# Altium schematic sheet MDBU020.SchDoc (part 2 of 2)
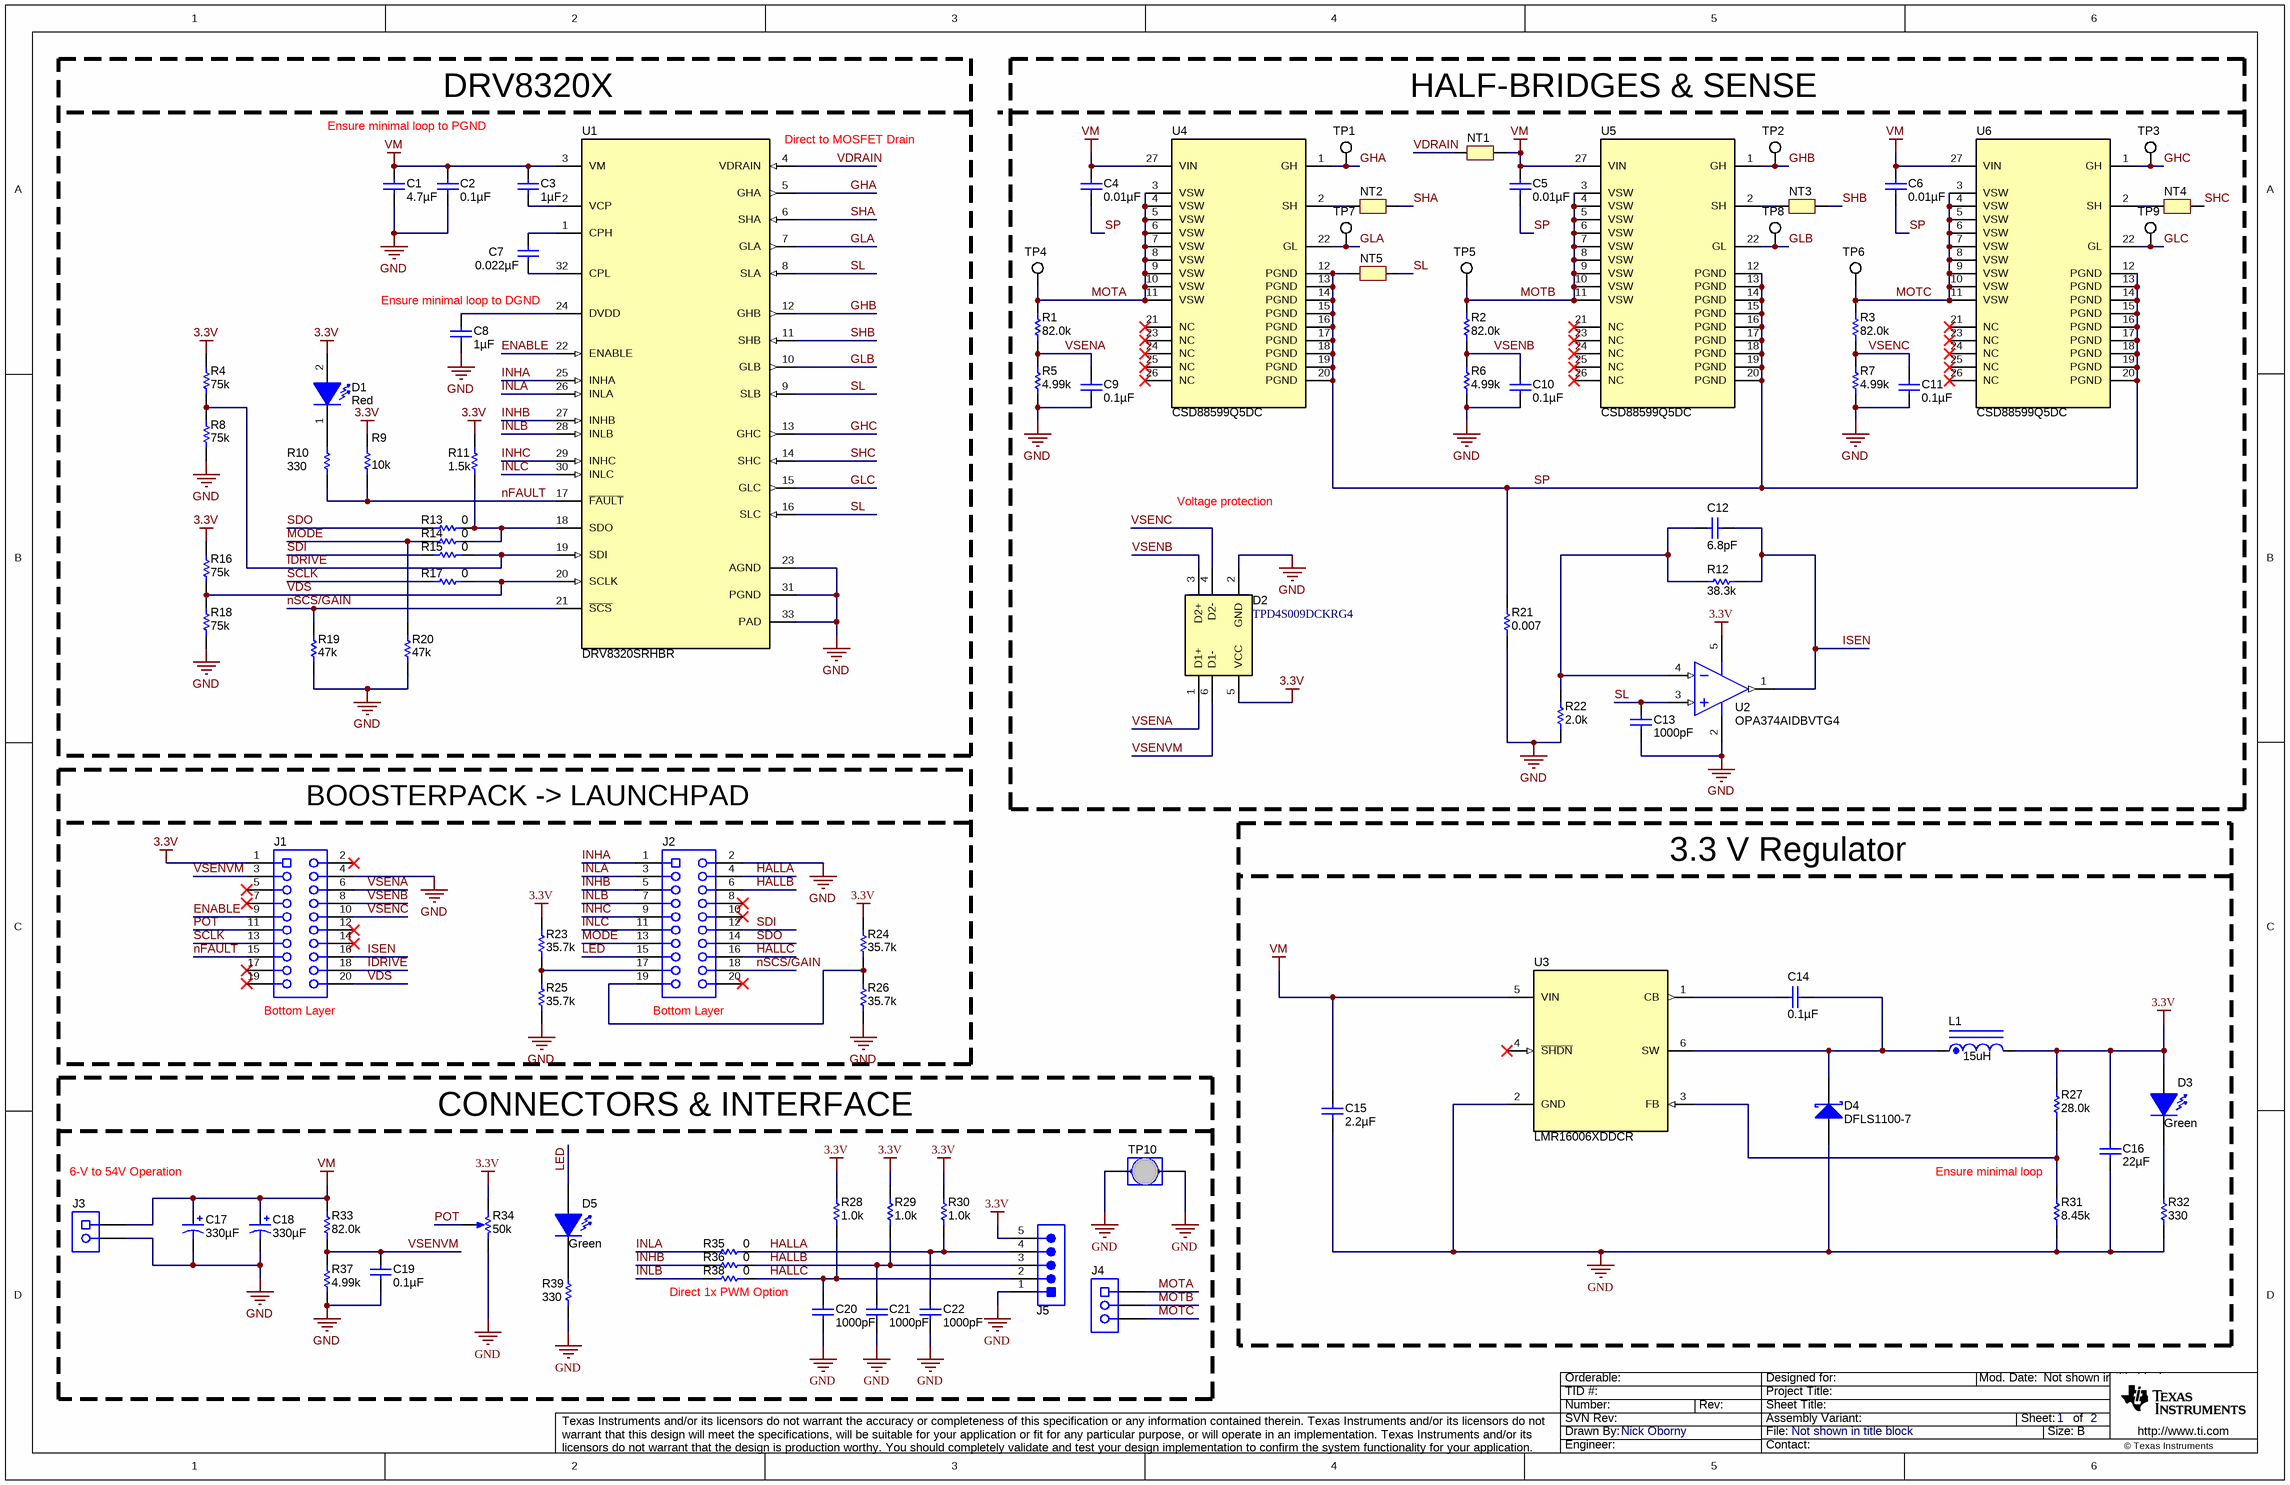
[diagram p1: MDBU020.SchDoc]

## Library data of the parts
C1 = CGA6M3X7S2A475K200AB: CAP, CERM, 4.7 µF, 100 V, +/- 10%, X7S, AEC-Q200 Grade 1, 1210; Manufacturer: TDK; Polarized: N; CompType: Capacitor; Value: 4.7uF; U/M: EA; Cap_F: 0.0000047; Tolerance_%: 10; ESR_ohm: 0.004236; Value1: 0.004236 ohm; VDC_V: 100; Value2: 100V; IRMS_A: 3.57337; TaMin_C: -55; TaMax_C: 125; Cap_Case: 1210_220; SizeArea_mm2: 8; SizeAreaWB_mm2: 14.7; SizeX_mm: 3.2; SizeY_mm: 2.5; SizeZ_mm: 2.2; AEC Category: Q200; AEC Qualified: Y; AEC Grade: 1; SymbolVersion: 2008-07-09; PartNumber: CGA6M3X7S2A475K200AB; PackageReference: 1210; RoHS: Y; MountType: SMT; Technology: Ceramic; TempCo: X7S; Published: 2008-06-19; Publisher: Texas Instruments; LatestRevisionDate: 2017-04-03; ComponentLink1Description: Datasheet link; ComponentLink1URL: https://product.tdk.com/en/search/capacitor/ceramic/mlcc/info?part_no=CGA6M3X7S2A475K200AB; Supplier 1: Digi-Key; Supplier Part Number 1: 445-7005-1-ND; Supplier 2: Mouser; Supplier Part Number 2: 810-CGA6M3X7S2A475K200AB
C2 = C1608X7S2A104K080AB: CAP, CERM, 0.1 µF, 100 V, +/- 10%, X7S, 0603; Manufacturer: TDK; Polarized: N; CompType: Capacitor; Value: 0.1uF; U/M: EA; Cap_F: 0.0000001; Tolerance_%: 10; ESR_ohm: 0.04959; Value1: 0.04959 ohm; VDC_V: 100; Value2: 100V; IRMS_A: 0.751618; TaMin_C: -55; TaMax_C: 125; Cap_Case: 0603; AEC Category: Q200; SizeArea_mm2: 1.28; SizeAreaWB_mm2: 4.68; SizeX_mm: 1.6; SizeY_mm: 0.8; SizeZ_mm: 1; SymbolVersion: 2008-07-09; PartNumber: C1608X7S2A104K080AB; PackageReference: 0603; RoHS: Y; MountType: SMT; Technology: Ceramic; TempCo: X7S; Published: 2008-06-19; Publisher: Texas Instruments; LatestRevisionDate: 2017-04-03; ComponentLink1Description: Datasheet link; ComponentLink1URL: https://product.tdk.com/en/search/capacitor/ceramic/mlcc/info?part_no=C1608X7S2A104K080AB; Supplier 1: Digi-Key; Supplier Part Number 1: 445-5201-1-ND; Supplier 2: Mouser; Supplier Part Number 2: 810-C1608X7S2A104K080AB; AEC Qualified: N; AEC Grade: N/A
C3 = GRM188R71C105KA12D: CAP, CERM, 1 µF, 16 V, +/- 10%, X7R, 0603; Manufacturer: MuRata; Polarized: N; CompType: Capacitor; Value: 1uF; U/M: EA; Cap_F: 0.000001; Tolerance_%: 10; ESR_ohm: 0.011; Value1: 0.011 ohm; VDC_V: 16; Value2: 16V; TaMin_C: -55; TaMax_C: 125; Cap_Case: 0603; SizeArea_mm2: 1.28; SizeAreaWB_mm2: 4.68; SizeX_mm: 1.6; SizeY_mm: 0.8; SizeZ_mm: 1; AEC Category: Q200; SymbolVersion: 2008-07-09; PartNumber: GRM188R71C105KA12D; PackageReference: 0603; RoHS: Y; MountType: SMT; Technology: Ceramic; TempCo: X7R; Published: 2008-06-19; Publisher: Texas Instruments; LatestRevisionDate: 2017-04-03; ComponentLink1Description: Datasheet link; ComponentLink1URL: http://search.murata.co.jp/Ceramy/PnsearchViewAction.do?HnOFG=ON&HnNFG=ON&SEL_CNT=50&sLang=en&sKey=GRM188R71C105KA12D&x=9&y=9&search=startwith; Supplier 1: Digi-Key; Supplier Part Number 1: 490-3900-1-ND; Supplier 2: Mouser; Supplier Part Number 2: 81-GRM188R71C105KA12; Supplier 3: Farnell; Supplier Part Number 3: 1828826; AEC Qualified: ?
C4-C6 = GRM188R72A103KA01D: CAP, CERM, 0.01 µF, 100 V, +/- 10%, X7R, 0603; Manufacturer: MuRata; Polarized: N; CompType: Capacitor; Value: 0.01uF; U/M: EA; Cap_F: 0.00000001; Tolerance_%: 10; Value1: Unknown; VDC_V: 100; Value2: 100V; TaMin_C: -55; TaMax_C: 125; Cap_Case: 0603; AEC Category: Q200; SizeArea_mm2: 1.28; SizeAreaWB_mm2: 4.68; SizeX_mm: 1.6; SizeY_mm: 0.8; SizeZ_mm: 1; SymbolVersion: 2008-07-09; PartNumber: GRM188R72A103KA01D; PackageReference: 0603; RoHS: Y; MountType: SMT; Technology: Ceramic; TempCo: X7R; Published: 2008-06-19; Publisher: Texas Instruments; LatestRevisionDate: 2017-04-03; ComponentLink1Description: Datasheet link; ComponentLink1URL: http://search.murata.co.jp/Ceramy/PnsearchViewAction.do?HnOFG=ON&HnNFG=ON&SEL_CNT=50&sLang=en&sKey=GRM188R72A103KA01D&x=9&y=9&search=startwith; Supplier 1: Digi-Key; Supplier Part Number 1: GRM188R72A103KA01D-ND; Supplier 2: Mouser; Supplier Part Number 2: 81-GRM188R72A103KA1D; AEC Qualified: ?
C7 = C1608X7R2A223K: CAP, CERM, 0.022 µF, 100 V, +/- 10%, X7R, 0603; Manufacturer: TDK; Polarized: N; CompType: Capacitor; Value: 0.022uF; U/M: EA; Cap_F: 0.000000022; Tolerance_%: 10; ESR_ohm: 0.037; Value1: 0.037 ohm; VDC_V: 100; Value2: 100V; TaMin_C: -55; TaMax_C: 125; Cap_Case: 0603; AEC Category: Q200; SymbolVersion: 2008-07-09; PartNumber: C1608X7R2A223K; PackageReference: 0603; RoHS: Y; MountType: SMT; Technology: Ceramic; TempCo: X7R; Published: 2008-06-19; Publisher: Texas Instruments; LatestRevisionDate: 2016-03-19; ComponentLink1Description: Datasheet link; ComponentLink1URL: http://www.tdk.co.jp/tefe02/e412_c.pdf; Supplier 1: Digi-Key; Supplier Part Number 1: 445-2275-1-ND; Supplier 2: Farnell; Supplier Part Number 2: 1844406; AEC Qualified: ?
C8 = GRM188R70J105KA01D: CAP, CERM, 1 µF, 6.3 V, +/- 10%, X7R, 0603; Manufacturer: MuRata; Polarized: N; CompType: Capacitor; Value: 1uF; U/M: EA; Cap_F: 0.000001; Tolerance_%: 10; Value1: Unknown; VDC_V: 6.3; Value2: 6.3V; TaMin_C: -55; TaMax_C: 125; Cap_Case: 0603; AEC Category: Q200; SymbolVersion: 2008-07-09; PartNumber: GRM188R70J105KA01D; PackageReference: 0603; RoHS: Y; MountType: SMT; Technology: Ceramic; TempCo: X7R; Published: 2008-06-19; Publisher: Texas Instruments; LatestRevisionDate: 2016-03-19; ComponentLink1Description: Datasheet link; ComponentLink1URL: http://search.murata.co.jp/Ceramy/PnsearchViewAction.do?HnOFG=ON&HnNFG=ON&SEL_CNT=50&sLang=en&sKey=GRM188R70J105KA01D&x=9&y=9&search=startwith; Supplier 1: Digi-Key; Supplier Part Number 1: 490-3898-1-ND; Supplier 2: Mouser; Supplier Part Number 2: 81-GRM188R70J105KA01; Supplier 3: Farnell; Supplier Part Number 3: 1845765; AEC Qualified: ?
C9-C11 = GRM188R71C104KA01D: CAP, CERM, 0.1 µF, 16 V, +/- 10%, X7R, 0603; Manufacturer: MuRata; Polarized: N; CompType: Capacitor; Value: 0.1uF; U/M: EA; Cap_F: 0.0000001; Tolerance_%: 10; Value1: Unknown; VDC_V: 16; Value2: 16V; TaMin_C: -55; TaMax_C: 125; Cap_Case: 0603; SizeArea_mm2: 1.28; SizeAreaWB_mm2: 4.68; SizeX_mm: 1.6; SizeY_mm: 0.8; SizeZ_mm: 1; AEC Category: Q200; SymbolVersion: 2008-07-09; PartNumber: GRM188R71C104KA01D; PackageReference: 0603; RoHS: Y; MountType: SMT; Technology: Ceramic; TempCo: X7R; Published: 2008-06-19; Publisher: Texas Instruments; LatestRevisionDate: 2017-04-03; ComponentLink1Description: Datasheet link; ComponentLink1URL: http://search.murata.co.jp/Ceramy/PnsearchViewAction.do?HnOFG=ON&HnNFG=ON&SEL_CNT=50&sLang=en&sKey=GRM188R71C104KA01D&x=9&y=9&search=startwith; Supplier 1: Digi-Key; Supplier Part Number 1: 490-1532-1-ND; Supplier 2: Mouser; Supplier Part Number 2: 81-GRM39X104K16; Supplier 3: Farnell; Supplier Part Number 3: 1828890; AEC Qualified: ?
C12 = 06035A6R8CAT2A: CAP, CERM, 6.8 pF, 50 V, +/- 4%, C0G/NP0, 0603; Manufacturer: AVX; Polarized: N; CompType: Capacitor; Value: 6.8pF; U/M: EA; Cap_F: 0.0000000000068; Tolerance_%: 4; ESR_ohm: 0.505; Value1: 0.505 ohm; VDC_V: 50; Value2: 50V; TaMin_C: -55; TaMax_C: 125; Cap_Case: 0603; SizeArea_mm2: 1.28; SizeAreaWB_mm2: 4.68; SizeX_mm: 1.6; SizeY_mm: 0.8; SizeZ_mm: 1; AEC Category: Q200; SymbolVersion: 2008-07-09; PartNumber: 06035A6R8CAT2A; PackageReference: 0603; RoHS: Y; MountType: SMT; Technology: Ceramic; TempCo: C0G/NP0; Published: 2008-06-19; Publisher: Texas Instruments; LatestRevisionDate: 2016-07-21; ComponentLink1Description: Datasheet link; ComponentLink1URL: http://datasheets.avx.com/C0GNP0-Dielectric.pdf; Supplier 1: Digi-Key; Supplier Part Number 1: 478-1161-1-ND; Supplier 2: Mouser; Supplier Part Number 2: 581-06035A6R8CAT2A; Supplier 3: Farnell; Supplier Part Number 3: 1396258; AEC Qualified: N; AEC Grade: N/A
C13 C20-C22 = 885012206034: CAP, CERM, 1000 pF, 16 V, +/- 10%, X7R, 0603; Manufacturer: Wurth Elektronik; Polarized: N; CompType: Capacitor; Value: 1000pF; U/M: EA; Cap_F: 0.000000001; Tolerance_%: 10; Value1: Unknown; VDC_V: 16; Value2: 16V; TaMin_C: -55; TaMax_C: 125; Cap_Case: 0603; SizeArea_mm2: 1.28; SizeAreaWB_mm2: 4.68; SizeX_mm: 1.6; SizeY_mm: 0.8; SizeZ_mm: 1; AEC Category: Q200; SymbolVersion: 2008-07-09; PartNumber: 885012206034; PackageReference: 0603; RoHS: Y; MountType: SMT; Technology: Ceramic; TempCo: X7R; Published: 2008-06-19; Publisher: Texas Instruments; LatestRevisionDate: 2016-08-08; ComponentLink1Description: Datasheet link; ComponentLink1URL: http://katalog.we-online.de/pbs/datasheet/885012206034.pdf; Supplier 1: Mouser; Supplier Part Number 1: 710-885012206034; AEC Qualified: N; AEC Grade: N/A
C14 = 0603YC104JAT2A: CAP, CERM, 0.1 µF, 16 V, +/- 5%, X7R, 0603; Manufacturer: AVX; Polarized: N; CompType: Capacitor; Value: 0.1uF; U/M: EA; Cap_F: 0.0000001; Tolerance_%: 5; ESR_ohm: 0.039; Value1: 0.039 ohm; VDC_V: 16; Value2: 16V; TaMin_C: -55; TaMax_C: 125; Cap_Case: 0603; AEC Category: Q200; SymbolVersion: 2008-07-09; PartNumber: 0603YC104JAT2A; PackageReference: 0603; RoHS: Y; MountType: SMT; Technology: Ceramic; TempCo: X7R; Published: 2008-06-19; Publisher: Texas Instruments; LatestRevisionDate: 2016-03-19; ComponentLink1Description: Datasheet link; ComponentLink1URL: http://datasheets.avx.com/X7RDielectric.pdf; Supplier 1: Digi-Key; Supplier Part Number 1: 478-3726-1-ND; Supplier 2: Mouser; Supplier Part Number 2: 581-0603YC104J; Supplier 3: Farnell; Supplier Part Number 3: 1740612; AEC Qualified: N; AEC Grade: N/A
C15 = GRM32ER72A225KA35L: CAP, CERM, 2.2 µF, 100 V, +/- 10%, X7R, 1210; Manufacturer: MuRata; Polarized: N; CompType: Capacitor; Value: 2.2uF; U/M: EA; Cap_F: 0.0000022; Tolerance_%: 10; ESR_ohm: 0.007; Value1: 0.007 ohm; VDC_V: 100; Value2: 100V; IRMS_A: 4.4; TaMin_C: -55; TaMax_C: 125; Cap_Case: 1210; AEC Category: Q200; SymbolVersion: 2008-07-09; PartNumber: GRM32ER72A225KA35L; PackageReference: 1210; RoHS: Y; MountType: SMT; Technology: Ceramic; TempCo: X7R; Published: 2008-06-19; Publisher: Texas Instruments; LatestRevisionDate: 2016-03-19; ComponentLink1Description: Datasheet link; ComponentLink1URL: http://search.murata.co.jp/Ceramy/PnsearchViewAction.do?HnOFG=ON&HnNFG=ON&SEL_CNT=50&sLang=en&sKey=GRM32ER72A225KA35L&x=9&y=9&search=startwith; Supplier 1: Digi-Key; Supplier Part Number 1: 490-3385-1-ND; Supplier 2: Mouser; Supplier Part Number 2: 81-GRM32ER72A225KA35; Supplier 3: Farnell; Supplier Part Number 3: 1735547; AEC Qualified: ?
C16 = GRM31CR61A226KE19L: CAP, CERM, 22 µF, 10 V, +/- 10%, X5R, 1206; Manufacturer: MuRata; Polarized: N; CompType: Capacitor; Value: 22uF; U/M: EA; Cap_F: 0.000022; Tolerance_%: 10; Value1: Unknown; Value2: 10V; TaMin_C: -55; TaMax_C: 85; Cap_Case: 1206; SizeArea_mm2: 5.12; SizeAreaWB_mm2: 10.92; SizeX_mm: 3.2; SizeY_mm: 1.6; SizeZ_mm: 1.8; AEC Category: Q200; SymbolVersion: 2008-07-09; PartNumber: GRM31CR61A226KE19L; PackageReference: 1206; RoHS: Y; VDC_V: 10; MountType: SMT; Technology: Ceramic; TempCo: X5R; Published: 2008-06-19; Publisher: Texas Instruments; LatestRevisionDate: 2016-08-08; ComponentLink1Description: Datasheet link; ComponentLink1URL: http://search.murata.co.jp/Ceramy/PnsearchViewAction.do?HnOFG=ON&HnNFG=ON&SEL_CNT=50&sLang=en&sKey=GRM31CR61A226KE19L&x=9&y=9&search=startwith; Supplier 1: Digi-Key; Supplier Part Number 1: GRM31CR61A226KE19L-ND; Supplier 2: Mouser; Supplier Part Number 2: 81-GRM31CR61A226KE9L; Supplier 3: Farnell; Supplier Part Number 3: 1907515; AEC Qualified: ?
C17 C18 = EMVA630ADA331MKG5S: CAP, AL, 330 µF, 63 V, +/- 20%, SMD; Manufacturer: Chemi-Con; Polarized: Y; CompType: Capacitor; Value: 330uF; U/M: EA; Cap_F: 0.00033; Tolerance_%: 20; Value1: Unknown; VDC_V: 63; Value2: 63V; IRMS_A: 0.72; TaMin_C: -40; TaMax_C: 85; Cap_Case: 12.5x16mm; AEC Category: Q200; AEC Qualified: N; SymbolVersion: 2008-07-09; PartNumber: EMVA630ADA331MKG5S; PackageReference: KG5; RoHS: Y; MountType: SMT; Technology: AL; Series: MVA; Publisher: Texas Instruments; LatestRevisionDate: 2016-05-12; ComponentLink1Description: Datasheet link; ComponentLink1URL: http://www.chemi-con.co.jp/cgi-bin/CAT_DB/SEARCH/cat_db_al.cgi?e=e&j=p&pdfname=mva; Supplier 1: Digi-Key; Supplier Part Number 1: 565-2156-1-ND; AEC Grade: N/A
C19 = C0603C104K4RACTU: CAP, CERM, 0.1 µF, 16 V, +/- 10%, X7R, 0603; Manufacturer: Kemet; Polarized: N; CompType: Capacitor; Value: 0.1uF; U/M: EA; Cap_F: 0.0000001; Tolerance_%: 10; Value1: Unknown; VDC_V: 16; Value2: 16V; TaMin_C: -55; TaMax_C: 125; Cap_Case: 0603; SizeArea_mm2: 1.28; SizeAreaWB_mm2: 4.68; SizeX_mm: 1.6; SizeY_mm: 0.8; SizeZ_mm: 1; AEC Category: Q200; SymbolVersion: 2008-07-09; PartNumber: C0603C104K4RACTU; PackageReference: 0603; RoHS: Y; MountType: SMT; Technology: Ceramic; TempCo: X7R; Published: 2008-06-19; Publisher: Texas Instruments; LatestRevisionDate: 2017-04-03; ComponentLink1Description: Datasheet link; ComponentLink1URL: http://www.kemet.com/kemet/web/homepage/kechome.nsf/vapubfiles/F3102_Y5V.pdf/$file/F3102_Y5V.pdf; Supplier 1: Digi-Key; Supplier Part Number 1: 399-1096-1-ND; Supplier 2: Mouser; Supplier Part Number 2: 80-C0603C104K4R; Supplier 3: Farnell; Supplier Part Number 3: 1414610; AEC Qualified: ?
D1 = 150060RS75000: LED, Red, SMD; Manufacturer: Wurth Elektronik; Type: AlInGaP; Vf_V: 2; Value2: 2V; Io_A: 0.03; Vr_V: 5; Tjmax_C: 85; Power_TotalModule: 0.072; Value1: 0.072W; Angle: 140; U/M: EA; CompType: LED; PartNumber: 150060RS75000; SymbolVersion: 2008-11-06; MountType: SMT; RoHS: Y; PackageReference: LED_0603; Color: Red; Published: 2008-07-11; Publisher: Texas Instruments; ComponentLink1URL: http://katalog.we-online.de/led/datasheet/150060RS75000.pdf; ComponentLink1Description: Datasheet link; LatestRevisionDate: 2016-07-15; Supplier 1: Digi-Key; Supplier Part Number 1: 732-4978-1-ND; Supplier 2: Mouser; Supplier Part Number 2: 710-150060RS75000; Supplier 3: Farnell; Supplier Part Number 3: 2322071
D2 = TPD4S009DCKRG4: ESD Solution for High-Speed Differential Interface, 4 Channels, -40 to +85 degC, 6-pin SC70 (DCK), Green (RoHS & no Sb/Br); Manufacturer: Texas Instruments; Alternate PartNumber: Equivalent; Breakdown Voltage(Min)(V): 9; Differential Capacitance(pF): 0.05; IEC 61000-4-2 Contact(+/- kV): 8; IO Capacitance(Typ)(pF): 0.8; IO Leakage Current(nA): 10; PartNumber: TPD4S009DCKRG4; MountType: SMT; ComponentLink1Description: Datasheet; ComponentLink1URL: http://www.ti.com/general/docs/lit/getliterature.tsp?genericPartNumber=TPD4S009&fileType=pdf; PackageReference: DCK0006A; Alternate Manufacturer: Texas Instruments; Supplier 1: Digi-Key; Supplier Part Number 1: TPD4S009DCKRG4-ND; Supplier 2: Mouser; Supplier Part Number 2: 595-TPD4S009DCKRG4; DatasheetVersion: SLVS817E; PackageVersion: revG, Jan-2007; PackageDescription: 6-Pin Plastic Small-Outline Package, 2 x 1.3 mm Body, 0.65 mm Pitch, 2.1 mm Lead Span; Eco-Plan: Green (RoHS & no Sb/Br); IEC 61000-4-2 Air-Gap(+/- kV): 9; SubFamily: ESD Solution; Code_JEDEC: MO-203-AB; ComponentLink2Description: URL Link1; ComponentLink2URL: SamplesURL:http://www.ti.com/product/tpd4s009#samples
D3 D5 = LTST-C171GKT: LED, Green, SMD; Manufacturer: Lite-On; Type: AlInGaP; Vf_V: 2.1; Value2: 2.1V; Io_A: 20; Value1: W; U/M: EA; CompType: LED; PartNumber: LTST-C171GKT; SymbolVersion: 2008-12-08; MountType: SMT; RoHS: Y; PackageReference: LED_0805; Color: green; Published: 2008-07-11; Publisher: Texas Instruments; ComponentLink1URL: https://sps06.itg.ti.com/sites/KMS/crossdivteams/altium/docs/ComponentDatasheets/LTST-C171GKT.pdf; ComponentLink1Description: Datasheet link; Supplier 1: Digi-Key; Supplier Part Number 1: 160-1423-1-ND; Supplier 2: Mouser; Supplier Part Number 2: 859-LTST-C171GKT
  D3: LatestRevisionDate: 2013-09-07
  D5: LatestRevisionDate: 2015-12-18
D4 = DFLS1100-7: Diode, Schottky, 100 V, 1 A, PowerDI123; Manufacturer: Diodes Inc.; U/M: EA; Vf_V: 0.77; Value: 100V; Value1: 1A; Value2: 0.77V; Io_A: 1; Vr_V: 100; TJmax_C: 175; RJC_CperW: 7; SizeAreaWB_mm2: 13.066; SizeArea_mm2: 6.586; SizeX_mm: 3.7; SizeY_mm: 1.78; SizeZ_mm: 0.98; AEC Category: Q101; CompType: Diode; SymbolVersion: 2008-12-08; PartNumber: DFLS1100-7; PackageReference: PowerDI123; MountType: SMT; Type: Schottky; RoHS: Y; Published: 2008-06-26; Publisher: Texas Instruments; LatestRevisionDate: 2016-12-06; ComponentLink1Description: Datasheet link; ComponentLink1URL: http://www.diodes.com/datasheets/ds30497.pdf; Supplier 1: Digi-Key; Supplier Part Number 1: DFLS1100DICT-ND; Supplier 2: Mouser; Supplier Part Number 2: 621-DFLS1100-7; Supplier 3: Farnell; Supplier Part Number 3: 1713889; AEC Qualified: ?
J1 J2 = SSQ-110-03-G-D: Receptacle, 2.54mm, 10x2, Gold, TH; Manufacturer: Samtec; SymbolCreator: a0412235; Pitch_mm: 2.54; Gender: Female; Row_Count: 2; Current_A: 6.3; Voltage_V: 550; Cert_CSA: Y; Cert_CULUS: N; SymbolVersion: 2013-12-20; PartNumber: SSQ-110-03-G-D; PackageReference: Receptacle, 2.54mm, 10x2, TH; CompType: Receptacle; RoHS: Y; MountType: TH; ComponentLink1Description: Datasheet URL; ComponentLink1URL: https://www.samtec.com/ftppub/cpdf/SSQ-1XX-XX-XXX-X-XX-XXX-XX-X-MKT.pdf; Orientation: Vertical; PinCount: 20; RowSpacing_mm: 2.54; ContactFinish: Gold; Color: Black; Cert_UL: Y; Cert_VDE: N; Publisher: Texas Instruments; LatestRevisionDate: 2016-03-21
J3 = 691 101 710 002: Terminal Block, 5 mm, 2x1, Tin, TH; Manufacturer: Wurth Elektronik eiSos; SymbolCreator: a0412235; U/M: EA; SymbolVersion: 2013-09-04; PartNumber: 691 101 710 002; PackageReference: Terminal Block, 5 mm, 2x1, TH; CompType: Terminal Block; RoHS: Y; MountType: TH; ComponentLink1Description: Datasheet Link; ComponentLink1URL: http://katalog.we-online.de/em/datasheet/6911017100xx.pdf; Publisher: Texas Instruments; LatestRevisionDate: 2015-02-03; Supplier 1: Digi-Key; Supplier Part Number 1: 732-2026-ND; Supplier 2: Mouser; Supplier Part Number 2: 710-691101710002
J4 = 691 101 710 003: Terminal Block, 5 mm, 3x1, Tin, TH; Manufacturer: Wurth Elektronik eiSos; SymbolCreator: a0412235; U/M: EA; SymbolVersion: 2013-10-03; PartNumber: 691 101 710 003; PackageReference: Terminal Block, 5 mm, 3x1, TH; CompType: Terminal Block; RoHS: Y; MountType: TH; ComponentLink1Description: Datasheet Link; ComponentLink1URL: http://katalog.we-online.de/em/datasheet/6911017100xx.pdf; Publisher: Texas Instruments; LatestRevisionDate: 2015-02-03; Supplier 1: Digi-Key; Supplier Part Number 1: 732-2027-ND; Supplier 2: Mouser; Supplier Part Number 2: 710-691101710003
J5 = PEC05SAAN: Header, 2.54mm, 5x1, Tin, TH; Manufacturer: Sullins Connector Solutions; SymbolCreator: a0412235; Pitch_mm: 2.54; Gender: Male; Shrouded: N; Row_Count: 1; Current_A: 3; Voltage_V: 1800; Cert_UL: Y; SymbolVersion: 2013-12-22; PartNumber: PEC05SAAN; PackageReference: Header, 2.54mm, 5x1, TH; ClassName: Header; CompType: Header; RoHS: Y; MountType: TH; ComponentLink1Description: Datasheet URL; ComponentLink1URL: http://www.sullinscorp.com/catalogs/77_PAGE108-109_.100_MALE_HDR.pdf; Orientation: Vertical; PinCount: 5; ContactFinish: Tin; Color: Black; Publisher: Texas Instruments; LatestRevisionDate: 2016-03-04; Supplier 1: Digi-Key; Supplier Part Number 1: S1012E-05-ND
L1 = SD53-150-R: Inductor, Shielded Drum Core, Ferrite, 15 µH, 1.1 A, 0.122 ohm, SMD; Manufacturer: Cooper Bussman; SymbolCreator: a0412235; Ind_H: 15.0E-6; ValueDisplayed: 15µH; Imax_A: 1.1; Irms: 1.1A @ 40C rise; Isat: 1.1A @ 30% inductance drop; DCR_ohm: 0.122; Value2: 1.1A; SymbolVersion: 2013-02-25; PartNumber: SD53-150-R; CompType: Inductor; Value1: 0.122 ohm; Technology: Shielded Drum Core; MountType: SMT; Material: Ferrite; PackageReference: 5.72x3x5.2mm; Published: 2008-06-26; Publisher: Texas Instruments; LatestRevisionDate: 2015-02-09; ComponentLink1Description: Datasheet link; ComponentLink1URL: http://www.cooperindustries.com/content/dam/public/bussmann/Electronics/Resources/Data%20Sheets/Bus_Elx_DS_PM%204149_SD53_Series.pdf; RoHS: Y; Supplier 1: Digi-Key; Supplier Part Number 1: 513-1458-1-ND; Supplier 2: Mouser; Supplier Part Number 2: 704-SD53-150-R; Supplier 3: Newark; Supplier Part Number 3: 99M5528
NT1-NT5 = Net-Tie: Single point connection between nets.; SymbolCreator: codlsc; SymbolVersion: 2009-07-01; MountType: SMT; PackageReference: N/A; Publisher: Texas Instruments; LatestRevisionDate: 2014-12-30; LatestRevisionNote: Added Alternate PartNumber and Alternate Manufacturer parameters to appropriate components.
R1-R3 R33 = RC0603FR-0782KL: RES, 82.0 k, 1%, 0.1 W, 0603; Manufacturer: Yageo America; CompType: Resistor; Value: 82.0k; Res_ohm: 82000; Value_Code: 82k0; Tolerance_%: 1; Power_W: 0.1; Value2: 0.1W; VDC_V: 150; TempCo: 200 ppm/C; U/M: EA; AEC Category: Q200; SymbolVersion: 2009-05-29; PartNumber: RC0603FR-0782KL; PackageReference: 0603; RoHS: Y; Value1: 1%; MountType: SMT; Technology: Thick Film; Published: 2008-06-26; Publisher: Texas Instruments; LatestRevisionDate: 2016-03-05; ComponentLink1Description: Datasheet link; ComponentLink1URL: http://www.yageo.com/pdf/Pu-RC0603_51_PbFree_L_2.pdf; Supplier 1: Digi-Key; Supplier Part Number 1: 311-82.0KHRCT-ND; Supplier 2: Mouser; Supplier Part Number 2: 603-RC0603FR-0782KL; Supplier 3: Farnell; Supplier Part Number 3: 9238719; AEC Qualified: ?
R4 R8 R16 R18 = CRCW060375K0JNEA: RES, 75 k, 5%, 0.1 W, 0603; Manufacturer: Vishay-Dale; CompType: Resistor; Value: 75k; Res_ohm: 75000; Value_Code: 75k0; Tolerance_%: 5; Power_W: 0.1; Value2: 0.1W; VDC_V: 75; TempCo: 200 ppm/C; EIA_Code: E24; U/M: EA; AEC Category: Q200; SymbolVersion: 2009-05-29; PartNumber: CRCW060375K0JNEA; PackageReference: 0603; RoHS: Y; Value1: 5%; MountType: SMT; Technology: Thick Film; Published: 2008-06-26; Publisher: Texas Instruments; LatestRevisionDate: 2016-03-05; ComponentLink1Description: Datasheet link; ComponentLink1URL: http://www.vishay.com/docs/20035/dcrcwe3.pdf; Supplier 1: Digi-Key; Supplier Part Number 1: 541-75KGCT-ND; Supplier 2: Mouser; Supplier Part Number 2: 71-CRCW0603J-75K-E3; Supplier 3: Farnell; Supplier Part Number 3: 1570763; AEC Qualified: ?
R5-R7 R37 = RC0603FR-074K99L: RES, 4.99 k, 1%, 0.1 W, 0603; Manufacturer: Yageo America; CompType: Resistor; Value: 4.99k; Res_ohm: 4990; Value_Code: 4k99; Tolerance_%: 1; Power_W: 0.1; Value2: 0.1W; VDC_V: 150; TempCo: 200 ppm/C; EIA_Code: E96; U/M: EA; SymbolVersion: 2009-05-29; PartNumber: RC0603FR-074K99L; PackageReference: 0603; RoHS: Y; Value1: 1%; MountType: SMT; Technology: Thick Film; Published: 2008-06-26; Publisher: Texas Instruments; LatestRevisionDate: 2014-12-16; ComponentLink1Description: Datasheet link; ComponentLink1URL: http://www.yageo.com/pdf/Pu-RC0603_51_PbFree_L_2.pdf; Supplier 1: Digi-Key; Supplier Part Number 1: 311-4.99KHRCT-ND; Supplier 2: Mouser; Supplier Part Number 2: 603-RC0603FR-074K99L; Supplier 3: Farnell; Supplier Part Number 3: 1799345
R9 = CRCW060310K0JNEA: RES, 10 k, 5%, 0.1 W, 0603; Manufacturer: Vishay-Dale; CompType: Resistor; Value: 10k; Res_ohm: 10000; Value_Code: 10k0; Tolerance_%: 5; Power_W: 0.1; Value2: 0.1W; VDC_V: 75; TempCo: 200 ppm/C; EIA_Code: E24; U/M: EA; AEC Category: Q200; SymbolVersion: 2009-05-29; PartNumber: CRCW060310K0JNEA; PackageReference: 0603; RoHS: Y; Value1: 5%; MountType: SMT; Technology: Thick Film; Published: 2008-06-26; Publisher: Texas Instruments; LatestRevisionDate: 2016-03-05; ComponentLink1Description: Datasheet link; ComponentLink1URL: http://www.vishay.com/docs/20035/dcrcwe3.pdf; Supplier 1: Digi-Key; Supplier Part Number 1: 541-10KGCT-ND; Supplier 2: Mouser; Supplier Part Number 2: 71-CRCW0603J-10K-E3; Supplier 3: Farnell; Supplier Part Number 3: 1469749; AEC Qualified: ?
R10 = CRCW0603330RJNEA: RES, 330 ohm, 5%, 0.1W, 0603; Manufacturer: Vishay-Dale; CompType: Resistor; Value_Code: 330R; Tolerance_%: 5; Power_W: 0.1; VDC_V: 75; TempCo: 200 ppm/C; EIA_Code: E24; U/M: EA; SymbolVersion: 2009-05-29; PartNumber: CRCW0603330RJNEA; PackageReference: 0603; RoHS: Y; Res_ohm: 330; Value1: 5%; Value2: 0.1W; MountType: SMT; Technology: Thick Film; Published: 2008-06-26; Publisher: Texas Instruments; LatestRevisionDate: 2013-10-22; ComponentLink1Description: Datasheet link; ComponentLink1URL: http://www.vishay.com/docs/20035/dcrcwe3.pdf; Supplier 1: Digi-Key; Supplier Part Number 1: 541-330GCT-ND; Supplier 2: Mouser; Supplier Part Number 2: 71-CRCW0603J-330-E3; Supplier 3: Farnell; Supplier Part Number 3: 1692522
R11 = CRCW06031K50JNEA: RES, 1.5 k, 5%, 0.1 W, 0603; Manufacturer: Vishay-Dale; CompType: Resistor; Value: 1.5k; Res_ohm: 1500; Value_Code: 1k50; Tolerance_%: 5; Power_W: 0.1; Value2: 0.1W; VDC_V: 75; TempCo: 200 ppm/C; EIA_Code: E24; U/M: EA; AEC Category: Q200; SymbolVersion: 2009-05-29; PartNumber: CRCW06031K50JNEA; PackageReference: 0603; RoHS: Y; Value1: 5%; MountType: SMT; Technology: Thick Film; Published: 2008-06-26; Publisher: Texas Instruments; LatestRevisionDate: 2016-03-05; ComponentLink1Description: Datasheet link; ComponentLink1URL: http://www.vishay.com/docs/20035/dcrcwe3.pdf; Supplier 1: Digi-Key; Supplier Part Number 1: 541-1.5KGCT-ND; Supplier 2: Mouser; Supplier Part Number 2: 71-CRCW0603J-1.5K-E3; Supplier 3: Farnell; Supplier Part Number 3: 1531366; AEC Qualified: ?
R12 = CRCW060338K3FKEA: RES, 38.3 k, 1%, 0.1 W, 0603; Manufacturer: Vishay-Dale; CompType: Resistor; Value: 38.3k; Res_ohm: 38300; Value_Code: 38k3; Tolerance_%: 1; Power_W: 0.1; Value2: 0.1W; VDC_V: 75; TempCo: 100 ppm/C; SizeArea_mm2: 1.28; SizeX_mm: 1.6; SizeY_mm: 0.8; EIA_Code: E96; U/M: EA; AEC Category: Q200; SymbolVersion: 2009-05-29; PartNumber: CRCW060338K3FKEA; PackageReference: 0603; RoHS: Y; Value1: 1%; MountType: SMT; Technology: Thick Film; SizeZ_mm: 1; Published: 2008-06-26; Publisher: Texas Instruments; LatestRevisionDate: 2016-06-29; ComponentLink1Description: Datasheet link; ComponentLink1URL: http://www.vishay.com/docs/20035/dcrcwe3.pdf; Supplier 1: Digi-Key; Supplier Part Number 1: 541-38.3KHCT-ND; Supplier 2: Mouser; Supplier Part Number 2: 71-CRCW0603-38.3K-E3; Supplier 3: Farnell; Supplier Part Number 3: 1151972; AEC Qualified: ?
R13-R15 R17 R35 R36 R38 = CRCW06030000Z0EA: RES, 0, 5%, 0.1 W, 0603; Manufacturer: Vishay-Dale; CompType: Resistor; Value_Code: 0000; Tolerance_%: 5; Power_W: 0.1; Value2: 0.1W; VDC_V: 75; TempCo: 200 ppm/C; EIA_Code: E24; U/M: EA; AEC Category: Q200; SymbolVersion: 2009-05-29; PartNumber: CRCW06030000Z0EA; PackageReference: 0603; RoHS: Y; Res_ohm: 0; Value1: 5%; MountType: SMT; Technology: Thick Film; Published: 2008-06-26; Publisher: Texas Instruments; LatestRevisionDate: 2015-12-05; ComponentLink1Description: Datasheet link; ComponentLink1URL: http://www.vishay.com/docs/20035/dcrcwe3.pdf; Supplier 1: Digi-Key; Supplier Part Number 1: 541-0.0GCT-ND; Supplier 2: Mouser; Supplier Part Number 2: 71-CRCW0603-0-E3; Supplier 3: Farnell; Supplier Part Number 3: 1469739; ValueDisplayed: 0; AEC Qualified: ?
R19 R20 = CRCW060347K0JNEA: RES, 47 k, 5%, 0.1 W, 0603; Manufacturer: Vishay-Dale; CompType: Resistor; Value: 47k; Res_ohm: 47000; Value_Code: 47k0; Tolerance_%: 5; Power_W: 0.1; Value2: 0.1W; VDC_V: 75; TempCo: 200 ppm/C; EIA_Code: E24; U/M: EA; AEC Category: Q200; SymbolVersion: 2009-05-29; PartNumber: CRCW060347K0JNEA; PackageReference: 0603; RoHS: Y; Value1: 5%; MountType: SMT; Technology: Thick Film; Published: 2008-06-26; Publisher: Texas Instruments; LatestRevisionDate: 2016-03-05; ComponentLink1Description: Datasheet link; ComponentLink1URL: http://www.vishay.com/docs/20035/dcrcwe3.pdf; Supplier 1: Digi-Key; Supplier Part Number 1: 541-47KGCT-ND; Supplier 2: Mouser; Supplier Part Number 2: 71-CRCW060347K0JNEA; Supplier 3: Farnell; Supplier Part Number 3: 1652881; AEC Qualified: ?
R21 = PMR100HZPFU7L00: RES SMD 0.007 OHM 1% 3W 2512; Manufacturer: Bourns Inc.; CompType: Resistor; Value: 0.007; Value_Code: 7L000; Tolerance_%: 1; Power_W: 3; TempCo: 100 ppm/C; EIA_Code: E96; U/M: EA; SymbolVersion: 2009-05-29; PartNumber: CRE2512-FZ-R007E-3; PackageReference: 2512; RoHS: Y; Res_ohm: 0.007; Value1: 1%; Value2: 3W; MountType: SMT; Technology: Thick Film; Published: 2008-06-26; Publisher: Texas Instruments; LatestRevisionDate: 2014-12-15; ComponentLink1Description: Datasheet link; ComponentLink1URL: http://media.digikey.com/pdf/Data%20Sheets/Rohm%20PDFs/PMR100-SERIES.pdf; Supplier 1: Digi-Key; Supplier Part Number 1: CRE2512-FZ-R007E-3CT-ND
R22 = CRCW06032K00JNEA: RES, 2.0 k, 5%, 0.1 W, 0603; Manufacturer: Vishay-Dale; CompType: Resistor; Value: 2.0k; Res_ohm: 2000; Value_Code: 2k00; Tolerance_%: 5; Power_W: 0.1; Value2: 0.1W; VDC_V: 75; TempCo: 200 ppm/C; SizeArea_mm2: 1.28; SizeX_mm: 1.6; SizeY_mm: 0.8; SizeZ_mm: 1; EIA_Code: E24; U/M: EA; AEC Category: Q200; SymbolVersion: 2009-05-29; PartNumber: CRCW06032K00JNEA; PackageReference: 0603; RoHS: Y; Value1: 5%; MountType: SMT; Technology: Thick Film; Published: 2008-06-26; Publisher: Texas Instruments; LatestRevisionDate: 2016-06-29; ComponentLink1Description: Datasheet link; ComponentLink1URL: http://www.vishay.com/docs/20035/dcrcwe3.pdf; Supplier 1: Digi-Key; Supplier Part Number 1: 541-2.0KGCT-ND; Supplier 2: Mouser; Supplier Part Number 2: 71-CRCW06032K00JNEA; Supplier 3: Farnell; Supplier Part Number 3: 1514727; AEC Qualified: ?
R23-R26 = RC0603FR-0735K7L: RES, 35.7 k, 1%, 0.1 W, 0603; Manufacturer: Yageo America; CompType: Resistor; Value: 35.7k; Res_ohm: 35700; Value_Code: 35k7; Tolerance_%: 1; Power_W: 0.1; Value2: 0.1W; VDC_V: 150; TempCo: 200 ppm/C; SizeArea_mm2: 1.28; SizeX_mm: 1.6; SizeY_mm: 0.8; EIA_Code: E96; U/M: EA; AEC Category: Q200; SymbolVersion: 2009-05-29; PartNumber: RC0603FR-0735K7L; PackageReference: 0603; RoHS: Y; Value1: 1%; MountType: SMT; Technology: Thick Film; SizeZ_mm: 1; Published: 2008-06-26; Publisher: Texas Instruments; LatestRevisionDate: 2016-06-29; ComponentLink1Description: Datasheet link; ComponentLink1URL: http://www.yageo.com/pdf/Pu-RC0603_51_PbFree_L_2.pdf; Supplier 1: Digi-Key; Supplier Part Number 1: 311-35.7KHRCT-ND; Supplier 2: Mouser; Supplier Part Number 2: 603-RC0603FR-0735K7L; AEC Qualified: ?
R27 = CRCW060328K0FKEA: RES, 28.0 k, 1%, 0.1 W, 0603; Manufacturer: Vishay-Dale; CompType: Resistor; Value: 28.0k; Res_ohm: 28000; Value_Code: 28k0; Tolerance_%: 1; Power_W: 0.1; Value2: 0.1W; VDC_V: 75; TempCo: 100 ppm/C; EIA_Code: E96; U/M: EA; AEC Category: Q200; SymbolVersion: 2009-05-29; PartNumber: CRCW060328K0FKEA; PackageReference: 0603; RoHS: Y; Value1: 1%; MountType: SMT; Technology: Thick Film; Published: 2008-06-26; Publisher: Texas Instruments; LatestRevisionDate: 2016-03-05; ComponentLink1Description: Datasheet link; ComponentLink1URL: http://www.vishay.com/docs/20035/dcrcwe3.pdf; Supplier 1: Digi-Key; Supplier Part Number 1: 541-28.0KHCT-ND; Supplier 2: Mouser; Supplier Part Number 2: 71-CRCW0603-28K-E3; Supplier 3: Farnell; Supplier Part Number 3: 1151883; AEC Qualified: ?
R28-R30 = CRCW06031K00JNEA: RES, 1.0 k, 5%, 0.1 W, 0603; Manufacturer: Vishay-Dale; CompType: Resistor; Value: 1.0k; Res_ohm: 1000; Value_Code: 1k00; Tolerance_%: 5; Power_W: 0.1; Value2: 0.1W; VDC_V: 75; TempCo: 200 ppm/C; EIA_Code: E24; U/M: EA; AEC Category: Q200; SymbolVersion: 2009-05-29; PartNumber: CRCW06031K00JNEA; PackageReference: 0603; RoHS: Y; Value1: 5%; MountType: SMT; Technology: Thick Film; Published: 2008-06-26; Publisher: Texas Instruments; LatestRevisionDate: 2016-03-05; ComponentLink1Description: Datasheet link; ComponentLink1URL: http://www.vishay.com/docs/20035/dcrcwe3.pdf; Supplier 1: Digi-Key; Supplier Part Number 1: 541-1.0KGCT-ND; Supplier 2: Mouser; Supplier Part Number 2: 71-CRCW0603J-1.0K-E3; Supplier 3: Farnell; Supplier Part Number 3: 1652851; AEC Qualified: ?
R31 = CRCW06038K45FKEA: RES, 8.45 k, 1%, 0.1 W, 0603; Manufacturer: Vishay-Dale; CompType: Resistor; Value: 8.45k; Res_ohm: 8450; Value_Code: 8k45; Tolerance_%: 1; Power_W: 0.1; Value2: 0.1W; VDC_V: 75; TempCo: 100 ppm/C; EIA_Code: E96; U/M: EA; AEC Category: Q200; SymbolVersion: 2009-05-29; PartNumber: CRCW06038K45FKEA; PackageReference: 0603; RoHS: Y; Value1: 1%; MountType: SMT; Technology: Thick Film; Published: 2008-06-26; Publisher: Texas Instruments; LatestRevisionDate: 2016-03-05; ComponentLink1Description: Datasheet link; ComponentLink1URL: http://www.vishay.com/docs/20035/dcrcwe3.pdf; Supplier 1: Digi-Key; Supplier Part Number 1: 541-8.45KHCT-ND; Supplier 2: Mouser; Supplier Part Number 2: 71-CRCW0603-8.45K-E3; Supplier 3: Farnell; Supplier Part Number 3: 1152135; AEC Qualified: ?
R32 = RC0603JR-07330RL: RES, 330, 5%, 0.1 W, 0603; Manufacturer: Yageo America; CompType: Resistor; Value: 330; Value_Code: 330R; Tolerance_%: 5; Power_W: 0.1; Value2: 0.1W; VDC_V: 50; TempCo: 100 ppm/C; SizeArea_mm2: 1.28; SizeX_mm: 1.6; SizeY_mm: 0.8; SizeZ_mm: 1; EIA_Code: E24; U/M: EA; AEC Category: Q200; SymbolVersion: 2009-05-29; PartNumber: RC0603JR-07330RL; PackageReference: 0603; RoHS: Y; Res_ohm: 330; Value1: 5%; MountType: SMT; Technology: Thick Film; Published: 2008-06-26; Publisher: Texas Instruments; LatestRevisionDate: 2016-06-29; ComponentLink1Description: Datasheet link; ComponentLink1URL: http://www.yageo.com/pdf/Pu-RC0603_51_PbFree_L_2.pdf; Supplier 1: Digi-Key; Supplier Part Number 1: 311-330GRCT-ND; Supplier 2: Mouser; Supplier Part Number 2: 603-RC0603JR-07330RL; Supplier 3: Farnell; Supplier Part Number 3: 9233318; AEC Qualified: ?
R34 = 3352T-1-503LF: Trimming Potentiometer, 50K, 0.5W, TH; Manufacturer: Bourns; Sim Note: Enter the Resistance value and the set point into parameter fields.; SymbolCreator: a0412235; CompType: Trimmer; SymbolVersion: 2012-12-27; PartNumber: 3352T-1-503LF; MountType: TH; ComponentLink1Description: Datasheet Link; ComponentLink1URL: http://www.bourns.com/data/global/PDFs/3352.pdf; RoHS: Y; PackageReference: 9.53x8.89mm; Publisher: Texas Instruments; LatestRevisionDate: 2015-12-17; Supplier 1: Digi-Key; Supplier Part Number 1: 3352T-503LF-ND; Supplier 2: Mouser; Supplier Part Number 2: 652-3352T-1-503LF; Supplier 3: Farnell; Supplier Part Number 3: 1106991
R39 = CRCW0603330RJNEA: RES, 330, 5%, 0.1 W, 0603; Manufacturer: Vishay-Dale; CompType: Resistor; Value_Code: 330R; Tolerance_%: 5; Power_W: 0.1; Value2: 0.1W; VDC_V: 75; TempCo: 200 ppm/C; EIA_Code: E24; U/M: EA; AEC Category: Q200; SymbolVersion: 2009-05-29; PartNumber: CRCW0603330RJNEA; PackageReference: 0603; RoHS: Y; Res_ohm: 330; Value1: 5%; MountType: SMT; Technology: Thick Film; Published: 2008-06-26; Publisher: Texas Instruments; LatestRevisionDate: 2015-12-05; ComponentLink1Description: Datasheet link; ComponentLink1URL: http://www.vishay.com/docs/20035/dcrcwe3.pdf; Supplier 1: Digi-Key; Supplier Part Number 1: 541-330GCT-ND; Supplier 2: Mouser; Supplier Part Number 2: 71-CRCW0603J-330-E3; Supplier 3: Farnell; Supplier Part Number 3: 1692522; ValueDisplayed: 330; AEC Qualified: ?
TP1-TP9 = 5002: Test Point, Miniature, White, TH; Manufacturer: Keystone; CompType: Test Point Loop; U/M: EA; SymbolVersion: 2008-04-04; PartNumber: 5002; PackageReference: White Miniature Testpoint; RoHS: Y; MountType: TH; ComponentLink1Description: Datasheet Link; ComponentLink1URL: http://www.keyelco.com/userAssets/file/M60-2p60.pdf; Value: White; Publisher: Texas Instruments; LatestRevisionDate: 2015-08-25; Supplier 1: Digi-Key; Supplier Part Number 1: 36-5002-ND; Supplier 2: Newark; Supplier Part Number 2: 82H9632
TP10 = D3082-05: 1mm Uninsulated Shorting Plug, 10.16mm spacing, TH; Manufacturer: Harwin; SymbolCreator: a0799628; CompType: Jumper Wire; SymbolVersion: 2014-05-16; PartNumber: D3082-05; PackageReference: Shorting Plug, 10.16mm spacing, TH; RoHS: Y; MountType: TH; ComponentLink1Description: Datasheet URL; ComponentLink1URL: http://cdn.harwin.com/pdfs/D3080-D3083.pdf; Publisher: Texas Instruments; LatestRevisionDate: 2015-12-21; Supplier 1: Digi-Key; Supplier Part Number 1: 952-1873-ND; Supplier 2: Mouser; Supplier Part Number 2: 855-D3082-05
U1 = DRV8320SRHBR: 60-V Three-Phase Smart Gate Driver, RHB0032E; Alternate PartNumber: DRV8320SRHBT; Manufacturer: Texas Instruments; SymbolCreator: Altium; SizeArea_mm2: 25; SizeAreaWB_mm2: 49; SizeX_mm: 5; SizeZ_mm: 1; CompType: IC; U/M: EA; SymbolVersion: 2016-03-15; PartNumber: DRV8320SRHBR; PackageReference: RHB0032E; PackageDescription: VQFN-32; MountType: SMT; SizeY_mm: 5; ComponentLink1Description: Datasheet Link; ComponentLink1URL: https://sps06.itg.ti.com/sites/KMS/crossdivteams/altium/docs/ComponentDatasheets/DRV832x_032916.pdf; RoHS: Y; Publisher: Texas Instruments; LatestRevisionDate: 2016-07-06; Alternate Manufacturer: Texas Instruments
U2 = OPA374AIDBVTG4: 6.5 MHz, 585 uA, Rail-to-Rail I/O CMOS Operational Amplifier, 2.3 to 5.5 V, -40 to 125 degC, 5-pin SOT23 (DBV0005A), Green (RoHS & no Sb/Br); Manufacturer: Texas Instruments; Alternate PartNumber: Equivalent; CMRR(Min)(dB): 80; GBW(Typ)(MHz): 6.5; IIB(Max)(pA): 10; Iq per channel(Max)(mA): 0.75; Number of Channels: 1; Offset Drift(Typ)(uV/C): 3; Packing: SMALL T&R; Rating: Catalog; Slew Rate(Typ)(V/us): 5; Sub Family: High Output Current Amplifier (>=50mA), Low Input Bias Current Amp (<=10pA), Low Supply Voltage Amplifier (<=2.7V), Precision Amplifier; Total Supply Voltage(Max)(+5V is 5, +/-5V is 10): 5.5; Total Supply Voltage(Min)(+5V is 5, +/-5V is 10): 2.3; DatasheetVersion: SBOS279E; PackageVersion: 4073253-4/K, 03/2006; PackageReference: DBV0005A; PackageDescription: 5-Pin Plastic Small Outline, Body 1.6 x 2.9 mm, Pitch 0.95 mm; Supplier 1: Digi-Key; Supplier Part Number 1: OPA374AIDBVTG4-ND; Supplier 2: Farnell; Supplier Part Number 2: 1207056RL; Supplier 3: Farnell; Supplier Part Number 3: 1207056; Supplier 4: Newark; Supplier Part Number 4: 97K6840; Supplier 5: Newark; Supplier Part Number 5: 66K4007; Supplier 6: Mouser; Supplier Part Number 6: 595-OPA374AIDBVTG4; Eco-Plan: Green (RoHS & no Sb/Br); Vio (25C)(Max)(mV): 5; MountType: SMT; Code_JEDEC: MO-178; PartNumber: OPA374AIDBVTG4; ComponentLink1Description: Manufacturer URL; ComponentLink1URL: http://www.ti.com/; ComponentLink2Description: Datasheet; ComponentLink2URL: http://www.ti.com/lit/ds/symlink/opa374.pdf; ComponentLink3Description: Package Specification; ComponentLink3URL: http://www.ti.com/litv/pdf/mpds018i; Alternate Manufacturer: Texas Instruments
U3 = LMR16006XDDCR: Wide Input Voltage Range Buck Regulator with High Efficiency Sleep Mode, DDC0006A; Alternate PartNumber: LMR16006XDDCT; Manufacturer: Texas Instruments; SymbolCreator: x0208326; SizeArea_mm2: 4.8675; SizeAreaWB_mm2: 10.4675; SizeX_mm: 1.65; SizeY_mm: 2.95; SizeZ_mm: 0.87; CompType: IC; U/M: EA; SymbolVersion: 2016-3-1; PartNumber: LMR16006XDDCR; PackageReference: DDC0006A; PackageDescription: SOT-6; MountType: SMT; ComponentLink1Description: Datasheet Link; ComponentLink1URL: http://www.ti.com/lit/ds/symlink/lmr16006.pdf; RoHS: Y; Publisher: Texas Instruments; LatestRevisionDate: 2016-06-14; Alternate Manufacturer: Texas Instruments
U4-U6 = CSD88599Q5DC: 60 V Half-Bridge NexFE Power Block, DMM0022A (LSON-CLIP-27); Alternate PartNumber: CSD88599Q5DCT; Manufacturer: Texas Instruments; SymbolCreator: Altium; SizeArea_mm2: 30; SizeAreaWB_mm2: 56; SizeX_mm: 5; SizeY_mm: 6; SizeZ_mm: 1.05; CompType: IC; U/M: EA; SymbolVersion: 2016-08-25; PartNumber: CSD88599Q5DC; PackageReference: DMM0022A; PackageDescription: LSON-CLIP-27; MountType: SMT; ComponentLink1Description: Datasheet Link; ComponentLink1URL: https://sps06.itg.ti.com/sites/KMS/crossdivteams/altium/docs/ComponentDatasheets/CSD88599Q5DC.pdf; RoHS: Y; Publisher: Texas Instruments; LatestRevisionDate: 2016-11-02; Alternate Manufacturer: Texas Instruments